# Altium schematic sheet USB UART.SchDoc
size A4; SheetNumber: 8; SheetTotal: 16
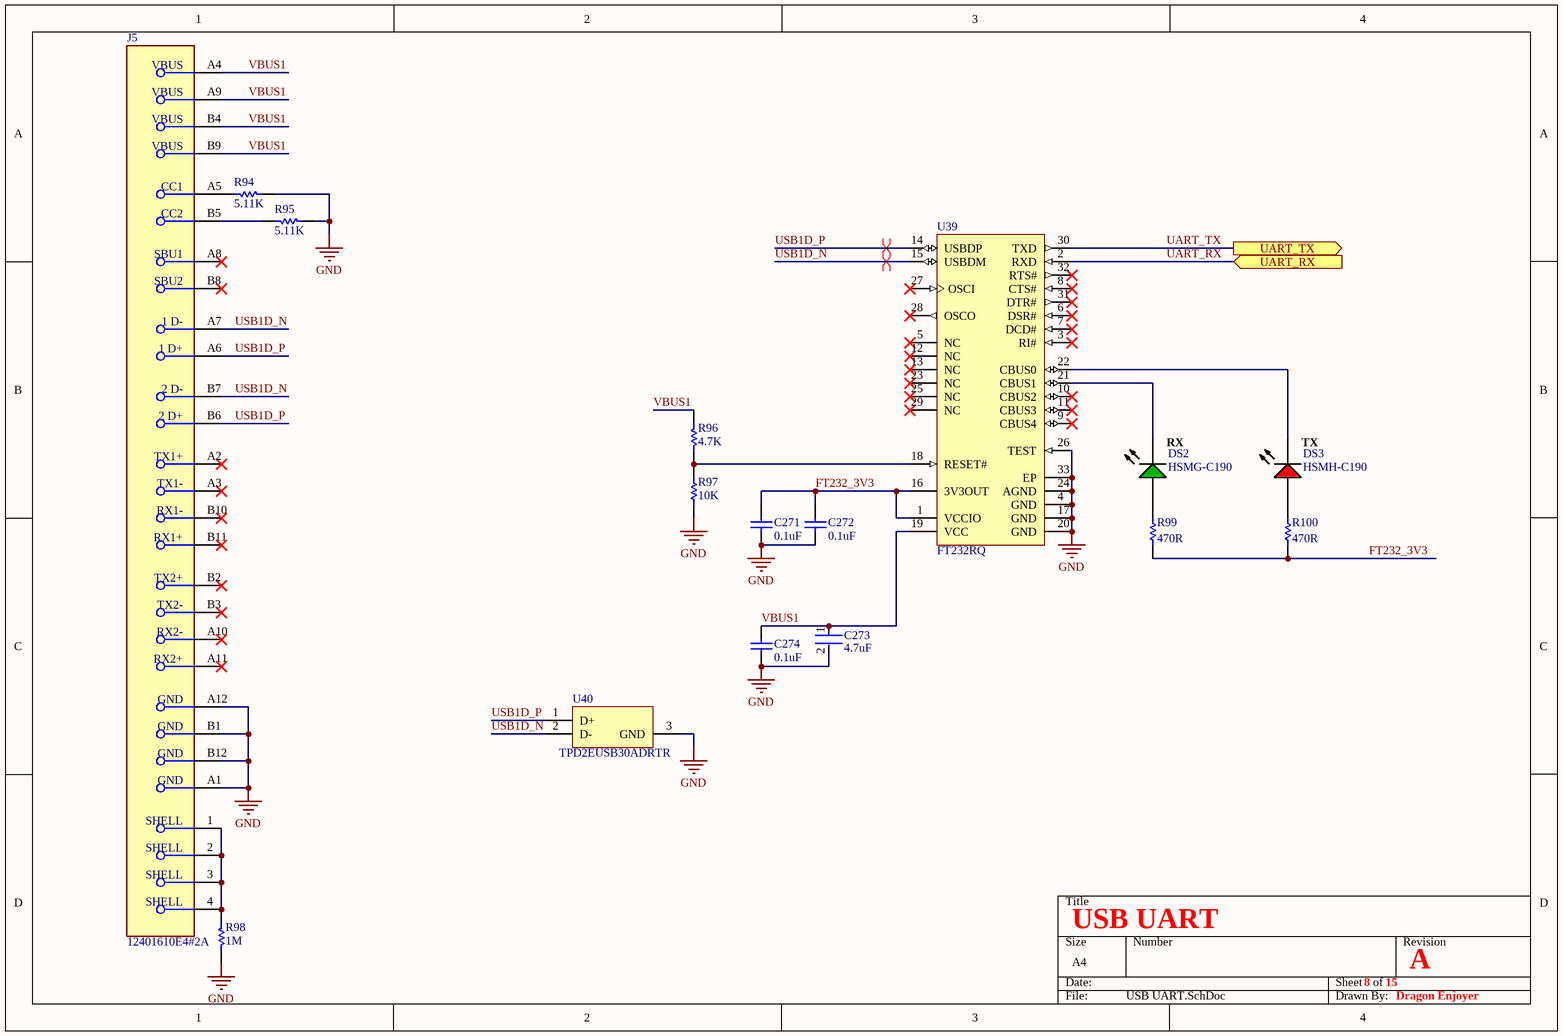
[diagram p0: USB UART.SchDoc]

## Parts
C271  value 0.1uF  [CAPC1005X56X25LL10T15]  (hidden comment: 04026D104KAT2A)
C272  value 0.1uF  [CAPC1005X56X25LL10T15]  (hidden comment: 04026D104KAT2A)
C273  Capacitance: 4.7uF  [FP-C1005-050-0_15-MFG]  (hidden comment: C1005X5R1A475K050BC)
C274  value 0.1uF  [CAPC1005X56X25LL10T15]  (hidden comment: 04026D104KAT2A)
DS2  HSMG-C190  [AVAG-HSMX-C190_V]
DS3  HSMH-C190  [AVAG-HSMX-C190_V]
J5  12401610E4#2A  [FP-12401610E4#2A-MFG]
R94  value 5.11K  [RESC0603X28X15ML05T05]  (hidden comment: CRCW02015K11FNED)
R95  value 5.11K  [RESC0603X28X15ML05T05]  (hidden comment: CRCW02015K11FNED)
R96  value 4.7K  [RESC1005X40X25LL05T10]  (hidden comment: RC0402JR-074K7L)
R97  value 10K  [RESC1005X40X25LL05T10]  (hidden comment: RC0402FR-0710KL)
R98  value 1M  [RESC1005X40X25ML05T05]  (hidden comment: ERJ-2GEJ105X)
R99  value 470R  [RESC0603X26X15LL03T05]  (hidden comment: ERJ1GNF4700C)
R100  value 470R  [RESC0603X26X15LL03T05]  (hidden comment: ERJ1GNF4700C)
U39  FT232RQ  [FTDI-QFN-32_3200X3200EP_V]
U40  TPD2EUSB30ADRTR  [DRT0003A]

## Ports
UART_RX (in), UART_TX (out)

## Nets
GND: C271.1 C272.1 C273.2 C274.1 J5.A1(GND) J5.A12(GND) J5.B1(GND) J5.B12(GND) R94.1 R95.1 R97.1 R98.1 U39.4(GND) U39.17(GND) U39.20(GND) U39.24(AGND) U39.26(TEST) U39.33(EP) U40.3(GND)
FT232_3V3: C271.2 C272.2 R99.1 R100.1 U39.1(VCCIO) U39.16(3V3OUT)
UART_RX: U39.2(RXD) ; port UART_RX
UART_TX: U39.30(TXD) ; port UART_TX
USB1D_N: J5.A7(1_D-) J5.B7(2_D-) U39.15(USBDM) U40.2(D-)
USB1D_P: J5.A6(1_D+) J5.B6(2_D+) U39.14(USBDP) U40.1(D+)
VBUS1: C273.1 C274.2 J5.A4(VBUS) J5.A9(VBUS) J5.B4(VBUS) J5.B9(VBUS) R96.2 U39.19(VCC)
NetDS2_1: DS2.1(A) R99.2
NetDS2_2: DS2.2(K) U39.21(CBUS1)
NetDS3_1: DS3.1(A) R100.2
NetDS3_2: DS3.2(K) U39.22(CBUS0)
NetJ5_1: J5.1(SHELL) J5.2(SHELL) J5.3(SHELL) J5.4(SHELL) R98.2
NetJ5_A5: J5.A5(CC1) R94.2
NetJ5_B5: J5.B5(CC2) R95.2
NetR96_1: R96.1 R97.2 U39.18(RESET#)

Not connected (* = marked no-connect by the designer): J5 A2(TX1+)* A3(TX1-)* A8(SBU1)* A10(RX2-)* A11(RX2+)* B2(TX2+)* B3(TX2-)* B8(SBU2)* B10(RX1-)* B11(RX1+)*; U39 3(RI#)* 5(NC)* 6(DSR#)* 7(DCD#)* 8(CTS#)* 9(CBUS4)* 10(CBUS2)* 11(CBUS3)* 12(NC)* 13(NC)* 23(NC)* 25(NC)* 27(OSCI)* 28(OSCO)* 29(NC)* 31(DTR#)* 32(RTS#)*

## Layout directives
differential pair: USB1D_N, USB1D_P

## Notes on the sheet
- (near DS2) RX
- (near DS3) TX
- USB UART
- 8
- 15
- A
- Dragon Enjoyer

## Library data of the parts
C271 C272 C274 = CMP-2008-02743-1: Manufacturer: AVX Interconnect / Elco; Part Number: 04026D104KAT2A
C273 = CMP-2000-05997-2: CAP CER 4.7UF 10V X5R 0402; Dielectric Material: Ceramic; Tolerance: 10%; Series: C; Package Quantity: 10000; Max Operating Temperature: 85°C; Case Code (Imperial): 0402; Lead Free: Lead Free; Voltage Rating (DC): 10V; Packaging: Cut Tape; Voltage Rating: 10V; Min Operating Temperature: -55°C; Dielectric: X5R; Thickness: 0.022inch; Width: 0.02inch; Case/Package: 0402; Case Code (Metric): 1005; Length: 0.039inch; RoHS Compliant: Yes; REACH SVHC: No SVHC; Mount: Surface Mount
DS2 = CMP-1744-00002-1: Chip LED, Green, 2.2 V, -40 to 85 degC, 2-Pin SMD, RoHS, Tape and Reel; Frequency: 400 KHz; Max Supply Voltage: 5.5 V; Access Time: 3500 ns; Clock Frequency: 100 KHz; Case\Package: SOIC; Density: 32 kb; Nominal Supply Current: 2 mA; Interface: Serial; Min Supply Voltage: 1.7 V; Packaging: Tape and Reel; PackageReference: HSMX-C190; ComponentLink2URL: http://docs.avagotech.com/docs/AV02-0551EN; RoHSCompliant: true; Pins: 8; REACH SVHC: No SVHC; Max Operating Temperature: 85 degC; Width: 4 mm; Radiation Hardening: No; Package Quantity: 3000; ComponentLink3Description: Package Specification; ComponentLink1Description: Manufacturer URL; Min Operating Temperature: -40 degC; PackageDescription: 2-Pin Surface Mount Device, Body 1.6 x 0.8 mm, Height 0.9 mm; Max Clock Frequency: 100 KHz; Height: 1.5 mm; ComponentLink1URL: http://www.avagotech.com/; DatasheetVersion: Mar-12; ComponentLink2Description: Datasheet; Mount: Surface Mount; Length: 5 mm; ComponentLink3URL: http://www.fairchildsemi.com/dwg/MA/MA03D.pdf
DS3 = CMP-1744-00004-1: LED Uni-Color Red, 65 mW, 20 mA, -40 to 85 degC, 2-Pin SMD, RoHS, Tape and Reel; Connector Type: USB; Gender: Male; Current Rating: 1 A; Length: 7.5 mm; Lead Pitch: 0.65 mm; PackageReference: HSMX-C190; Package Quantity: 2000; Max Operating Temperature: 85 degC; PackageDescription: 2-Pin Surface Mount Device, Body 1.6 x 0.8 mm, Height 0.9 mm; ComponentLink3Description: Package Specification; Mount: Surface Mount; Min Operating Temperature: -30 degC; ComponentLink3URL: http://www.fairchildsemi.com/dwg/MA/MA03D.pdf; ComponentLink1Description: Manufacturer URL; Contact Material: Copper; Pins: 5; Width: 5.6 mm; ComponentLink2Description: Datasheet; RoHSCompliant: true; DatasheetVersion: Mar-12; Height: 2.8 mm; Packaging: Tape and Reel; Contact Plating: Gold; ComponentLink1URL: http://www.avagotech.com/; REACH SVHC: No SVHC; ComponentLink2URL: http://docs.avagotech.com/docs/AV02-0551EN
J5 = CMP-02355-000003-1: CONN RCP USB3.1 TYPEC 24P SMD RA; Connector Type: USB; Number of Contacts: 24; Gender: Receptacle; Packaging: Cut Tape; Mount: Surface Mount; Number of Pins: 24
R94 R95 = CMP-2004-00740-1: Manufacturer: Vishay Dale; Part Number: CRCW02015K11FNED
R96 = CMP-2002-08011-1: Manufacturer: Yageo / Phycomp; Part Number: RC0402JR-074K7L
R97 = CMP-2002-07353-1: Manufacturer: Yageo / Phycomp; Part Number: RC0402FR-0710KL
R98 = CMP-1011-00146-2: Manufacturer: Panasonic; Part Number: ERJ-2GEJ105X
R99 R100 = CMP-1010-00379-2: Manufacturer: Panasonic; Part Number: ERJ1GNF4700C
U39 = CMP-2000-05133-1: USB-to-UART 1-CH 256byte FIFO 5V 32-Pin QFN EP Tray; Manufacturer: FTDI; No. of Pins: 32Pins; Bridge Type: USBtoUART; SVHC: NoSVHC(17-Dec-2015); Supply Voltage Min: 1.8V; Supply Voltage Max: 5.25V; Packaging: CutTape; Operating Temperature Max: 85degC; Datasheet Version: Rev. 1.04, 02/2006; Product Range: -; Manufacturer URL: http://www.ftdichip.com/; Operating Temperature Min: -40degC; Datasheet URL: http://datasheet.octopart.com/FT232RQ-FTDI-datasheet-120501.pdf; MSL: -; Interface Case Style: QFN
U40 = CMP-0326-00047-3: ESD / Surge Solution for High Speed, Low Voltage Interface, 2 Channels, -40 to +85 degC, 3-pin SOT (DRT), Green (RoHS & no Sb/Br); Manufacturer: Texas Instruments; IEC 61000-4-2 Air-Gap(+/- kV): 8; SubFamily: ESD Solution; 1394 / Firewire: TRUE; IO Leakage Current(nA): 10; Differential Capacitance(pF): 0.05; Breakdown Voltage(Min)(V): 4.5; IO Capacitance(Typ)(pF): 0.7; Mounting Technology: Surface Mount; PartNumber: TPD2EUSB30ADRTR; ComponentLink2URL: SamplesURL:http://www.ti.com/product/tpd2eusb30a#samples; IEC 61000-4-2 Contact(+/- kV): 8; PackageReference: DRT0003A; Eco-Plan: Green (RoHS & no Sb/Br); ComponentLink2Description: URL Link1; USB Full Speed: TRUE; USB High Speed: TRUE; PackageDescription: 3-Flat Lead Plastic Small Outline, 1 x 1 mm (inc leads), 0.35 mm Pitch; Serial ATA / eSATA: TRUE; ComponentLink1URL: http://www.ti.com/general/docs/lit/getliterature.tsp?genericPartNumber=TPD2EUSB30A&fileType=pdf; DatasheetVersion: SLVSAC2C; PackageVersion: revD, Jun-2008; ComponentLink1Description: Datasheet; HDMI: TRUE; USB Super Speed: TRUE